# Altium schematic sheet driver.SchDoc
size A3
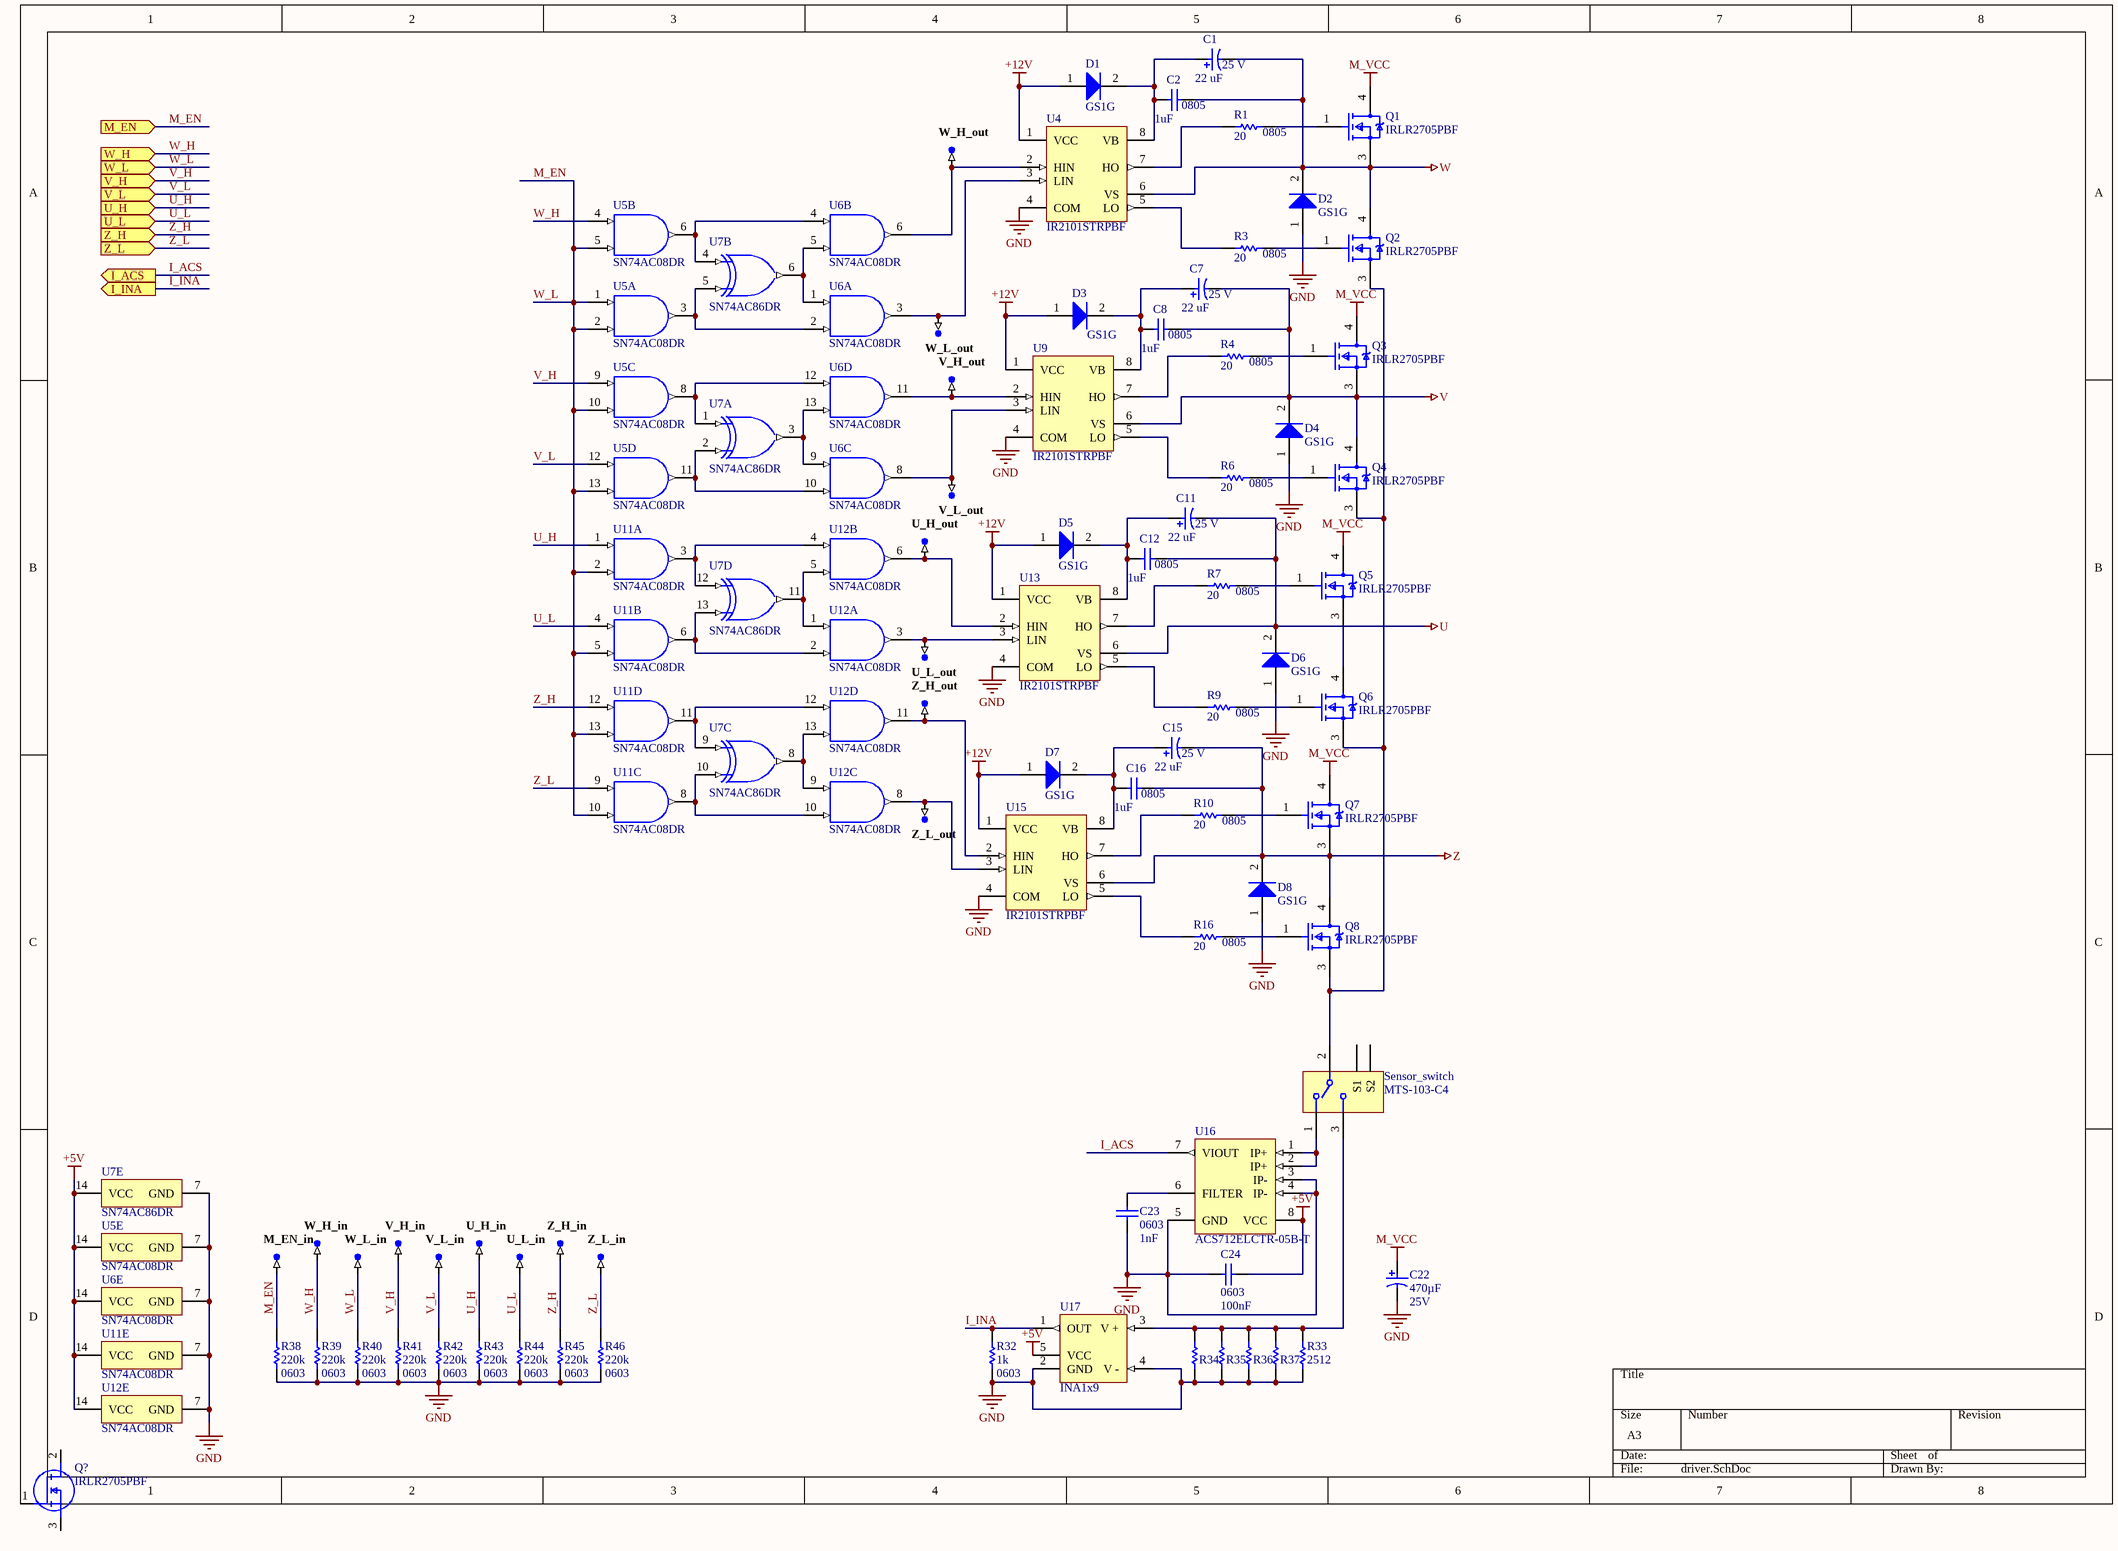
[diagram p0: driver.SchDoc]

## Parts
C1  Rated Voltage: 25 V  Capacitance: 22 uF  [PNSC-FT-V-43x43-2_V]  (hidden comment: EEE-FT1E220AR)
C2  value 1uF  Case-EIA: 0805  [CAPC0805(2012)145_M]  (hidden comment: CAP 1uF 50V 0805(2012))
C7  Rated Voltage: 25 V  Capacitance: 22 uF  [PNSC-FT-V-43x43-2_V]  (hidden comment: EEE-FT1E220AR)
C8  value 1uF  Case-EIA: 0805  [CAPC0805(2012)145_M]  (hidden comment: CAP 1uF 50V 0805(2012))
C11  Rated Voltage: 25 V  Capacitance: 22 uF  [PNSC-FT-V-43x43-2_V]  (hidden comment: EEE-FT1E220AR)
C12  value 1uF  Case-EIA: 0805  [CAPC0805(2012)145_M]  (hidden comment: CAP 1uF 50V 0805(2012))
C15  Rated Voltage: 25 V  Capacitance: 22 uF  [PNSC-FT-V-43x43-2_V]  (hidden comment: EEE-FT1E220AR)
C16  value 1uF  Case-EIA: 0805  [CAPC0805(2012)145_M]  (hidden comment: CAP 1uF 50V 0805(2012))
C22  Capacitance: 470µF  Rated Voltage: 25V  [PNSC-FP-V-G_V]  (hidden comment: EEEFP1E471AP)
C23  value 1nF  Case-EIA: 0603  [CAPC0603(1608)100_M]  (hidden comment: CAP 1nF 16V 0603(1608))
C24  Case Code (Imperial): 0603  Capacitance: 100nF  [CAPC1608X90X35ML10T15]  (hidden comment: GRM188R71H104KA93D)
D1  GS1G  [VISH-DO-214AC_V]
D2  GS1G  [VISH-DO-214AC_V]
D3  GS1G  [VISH-DO-214AC_V]
D4  GS1G  [VISH-DO-214AC_V]
D5  GS1G  [VISH-DO-214AC_V]
D6  GS1G  [VISH-DO-214AC_V]
D7  GS1G  [VISH-DO-214AC_V]
D8  GS1G  [VISH-DO-214AC_V]
M_EN_in  TP-SM-C-100  [TP-SM-C-100]  (value not drawn)  (no BOM)
Q1  IRLR2705PBF  [FP-PG-TO252-3-MFG]
Q2  IRLR2705PBF  [FP-PG-TO252-3-MFG]
Q3  IRLR2705PBF  [FP-PG-TO252-3-MFG]
Q4  IRLR2705PBF  [FP-PG-TO252-3-MFG]
Q5  IRLR2705PBF  [FP-PG-TO252-3-MFG]
Q6  IRLR2705PBF  [FP-PG-TO252-3-MFG]
Q7  IRLR2705PBF  [FP-PG-TO252-3-MFG]
Q8  IRLR2705PBF  [FP-PG-TO252-3-MFG]
Q?  IRLR2705PBF  [IRLR2705PBF]
R1  value 20  Case-EIA: 0805  [RESC0805(2012)_M]  (hidden comment: 20R 1% 0805(2012))
R3  value 20  Case-EIA: 0805  [RESC0805(2012)_M]  (hidden comment: 20R 1% 0805(2012))
R4  value 20  Case-EIA: 0805  [RESC0805(2012)_M]  (hidden comment: 20R 1% 0805(2012))
R6  value 20  Case-EIA: 0805  [RESC0805(2012)_M]  (hidden comment: 20R 1% 0805(2012))
R7  value 20  Case-EIA: 0805  [RESC0805(2012)_M]  (hidden comment: 20R 1% 0805(2012))
R9  value 20  Case-EIA: 0805  [RESC0805(2012)_M]  (hidden comment: 20R 1% 0805(2012))
R10  value 20  Case-EIA: 0805  [RESC0805(2012)_M]  (hidden comment: 20R 1% 0805(2012))
R16  value 20  Case-EIA: 0805  [RESC0805(2012)_M]  (hidden comment: 20R 1% 0805(2012))
R32  Resistance (Ohms): 1k  Package Reference: 0603  [RESC1608X55X30ML15T20]  (hidden comment: RMCF0603FT10K0)
R33  Case-EIA: 2512  [RESC2512(6432)_N]  (hidden comment: 1R 5% 2512(6432))
R34  1R 5% 2512(6432)  [RESC2512(6432)_N]  (value not drawn)
R35  1R 5% 2512(6432)  [RESC2512(6432)_N]  (value not drawn)
R36  1R 5% 2512(6432)  [RESC2512(6432)_N]  (value not drawn)
R37  1R 5% 2512(6432)  [RESC2512(6432)_N]  (value not drawn)
R38  Resistance (Ohms): 220k  Package Reference: 0603  [RESC1608X55X30ML15T20]  (hidden comment: RMCF0603FT10K0)
R39  Resistance (Ohms): 220k  Package Reference: 0603  [RESC1608X55X30ML15T20]  (hidden comment: RMCF0603FT10K0)
R40  Resistance (Ohms): 220k  Package Reference: 0603  [RESC1608X55X30ML15T20]  (hidden comment: RMCF0603FT10K0)
R41  Resistance (Ohms): 220k  Package Reference: 0603  [RESC1608X55X30ML15T20]  (hidden comment: RMCF0603FT10K0)
R42  Resistance (Ohms): 220k  Package Reference: 0603  [RESC1608X55X30ML15T20]  (hidden comment: RMCF0603FT10K0)
R43  Resistance (Ohms): 220k  Package Reference: 0603  [RESC1608X55X30ML15T20]  (hidden comment: RMCF0603FT10K0)
R44  Resistance (Ohms): 220k  Package Reference: 0603  [RESC1608X55X30ML15T20]  (hidden comment: RMCF0603FT10K0)
R45  Resistance (Ohms): 220k  Package Reference: 0603  [RESC1608X55X30ML15T20]  (hidden comment: RMCF0603FT10K0)
R46  Resistance (Ohms): 220k  Package Reference: 0603  [RESC1608X55X30ML15T20]  (hidden comment: RMCF0603FT10K0)
Sensor_switch  MTS-103-C4  [SALE-T8019L-5_V]
U4  IR2101STRPBF  [INTR-SOIC-8_V]
U5  SN74AC08DR  [D0014A_M]  (parts A,B,C,D,E of 5)
U6  SN74AC08DR  [D0014A_M]  (parts A,B,C,D,E of 5)
U7  SN74AC86DR  [D0014A_M]  (parts A,B,C,D,E of 5)
U9  IR2101STRPBF  [INTR-SOIC-8_V]
U11  SN74AC08DR  [D0014A_M]  (parts A,B,C,D,E of 5)
U12  SN74AC08DR  [D0014A_M]  (parts A,B,C,D,E of 5)
U13  IR2101STRPBF  [INTR-SOIC-8_V]
U15  IR2101STRPBF  [INTR-SOIC-8_V]
U16  ACS712ELCTR-05B-T  [ALEG-LC-8_V]
U17  INA1x9  [DIOD-SOT23-5_V]
U_H_in  TP-SM-C-100  [TP-SM-C-100]  (value not drawn)  (no BOM)
U_H_out  TP-SM-C-100  [TP-SM-C-100]  (value not drawn)  (no BOM)
U_L_in  TP-SM-C-100  [TP-SM-C-100]  (value not drawn)  (no BOM)
U_L_out  TP-SM-C-100  [TP-SM-C-100]  (value not drawn)  (no BOM)
V_H_in  TP-SM-C-100  [TP-SM-C-100]  (value not drawn)  (no BOM)
V_H_out  TP-SM-C-100  [TP-SM-C-100]  (value not drawn)  (no BOM)
V_L_in  TP-SM-C-100  [TP-SM-C-100]  (value not drawn)  (no BOM)
V_L_out  TP-SM-C-100  [TP-SM-C-100]  (value not drawn)  (no BOM)
W_H_in  TP-SM-C-100  [TP-SM-C-100]  (value not drawn)  (no BOM)
W_H_out  TP-SM-C-100  [TP-SM-C-100]  (value not drawn)  (no BOM)
W_L_in  TP-SM-C-100  [TP-SM-C-100]  (value not drawn)  (no BOM)
W_L_out  TP-SM-C-100  [TP-SM-C-100]  (value not drawn)  (no BOM)
Z_H_in  TP-SM-C-100  [TP-SM-C-100]  (value not drawn)  (no BOM)
Z_H_out  TP-SM-C-100  [TP-SM-C-100]  (value not drawn)  (no BOM)
Z_L_in  TP-SM-C-100  [TP-SM-C-100]  (value not drawn)  (no BOM)
Z_L_out  TP-SM-C-100  [TP-SM-C-100]  (value not drawn)  (no BOM)

## Ports
I_ACS (out), I_INA (out), M_EN (in), U_H (in), U_L (in), V_H (in), V_L (in), W_H (in), W_L (in), Z_H (in), Z_L (in)

## Nets
+5V: C24.2 U5.14(VCC) U6.14(VCC) U7.14(VCC) U11.14(VCC) U12.14(VCC) U16.8(VCC) U17.5(VCC)
+12V: D1.1(+) D3.1(+) D5.1(+) D7.1(+) U4.1(VCC) U9.1(VCC) U13.1(VCC) U15.1(VCC)
GND: C22.2 C23.1 C24.1 D2.1(+) D4.1(+) D6.1(+) D8.1(+) R32.1 R33.2 R34.2 R35.2 R36.2 R37.2 R38.1 R39.1 R40.1 R41.1 R42.1 R43.1 R44.1 R45.1 R46.1 U4.4(COM) U5.7(GND) U6.7(GND) U7.7(GND) U9.4(COM) U11.7(GND) U12.7(GND) U13.4(COM) U15.4(COM) U16.3(IP-) U16.4(IP-) U16.5(GND) U17.2(GND) U17.4(V_-)
M_VCC: C22.1 Q1.4(D) Q3.4(D) Q5.4(D) Q7.4(D)
U: C11.2 C12.1 D6.2(-) Q5.3(S) Q6.4(D) U13.6(VS)
V: C7.2 C8.1 D4.2(-) Q3.3(S) Q4.4(D) U9.6(VS)
W: C1.2 C2.1 D2.2(-) Q1.3(S) Q2.4(D) U4.6(VS)
Z: C15.2 C16.1 D8.2(-) Q7.3(S) Q8.4(D) U15.6(VS)
I_ACS: U16.7(VIOUT) ; port I_ACS
I_INA: R32.2 U17.1(OUT) ; port I_INA
M_EN: M_EN_in.1 R38.2 R40.2 U5.1(1A) U5.2(1B) U5.5(2B) U5.10(3B) U5.13(4B) U11.2(1B) U11.5(2B) U11.10(3B) U11.13(4B) W_L_in.1 ; port W_L, port M_EN  [also labelled W_L]
U_H: R43.2 U11.1(1A) U_H_in.1 ; port U_H
U_L: R44.2 U11.4(2A) U_L_in.1 ; port U_L
V_H: R41.2 U5.9(3A) V_H_in.1 ; port V_H
V_L: R42.2 U5.12(4A) V_L_in.1 ; port V_L
W_H: R39.2 U5.4(2A) W_H_in.1 ; port W_H
Z_H: R45.2 U11.12(4A) Z_H_in.1 ; port Z_H
Z_L: R46.2 U11.9(3A) Z_L_in.1 ; port Z_L
NetC1_1: C1.1 C2.2 D1.2(-) U4.8(VB)
NetC7_1: C7.1 C8.2 D3.2(-) U9.8(VB)
NetC11_1: C11.1 C12.2 D5.2(-) U13.8(VB)
NetC15_1: C15.1 C16.2 D7.2(-) U15.8(VB)
NetC23_2: C23.2 U16.6(FILTER)
NetQ1_1: Q1.1(G) R1.1
NetQ2_1: Q2.1(G) R3.1
NetQ2_3: Q2.3(S) Q4.3(S) Q6.3(S) Q8.3(S) Sensor_switch.2
NetQ3_1: Q3.1(G) R4.1
NetQ4_1: Q4.1(G) R6.1
NetQ5_1: Q5.1(G) R7.1
NetQ6_1: Q6.1(G) R9.1
NetQ7_1: Q7.1(G) R10.1
NetQ8_1: Q8.1(G) R16.1
NetR1_2: R1.2 U4.7(HO)
NetR3_2: R3.2 U4.5(LO)
NetR4_2: R4.2 U9.7(HO)
NetR6_2: R6.2 U9.5(LO)
NetR7_2: R7.2 U13.7(HO)
NetR9_2: R9.2 U13.5(LO)
NetR10_2: R10.2 U15.7(HO)
NetR16_2: R16.2 U15.5(LO)
NetR33_1: R33.1 R34.1 R35.1 R36.1 R37.1 Sensor_switch.3 U17.3(V_+)
NetSensor_switch_1: Sensor_switch.1 U16.1(IP+) U16.2(IP+)
NetU4_2: U4.2(HIN) U6.6(2Y) W_H_out.1
NetU4_3: U4.3(LIN) U6.3(1Y) W_L_out.1
NetU5_3: U5.3(1Y) U6.2(1B) U7.5(2B)
NetU5_6: U5.6(2Y) U6.4(2A) U7.4(2A)
NetU5_8: U5.8(3Y) U6.12(4A) U7.1(1A)
NetU5_11: U5.11(4Y) U6.10(3B) U7.2(1B)
NetU6_1: U6.1(1A) U6.5(2B) U7.6(2Y)
NetU6_8: U6.8(3Y) U9.3(LIN) V_L_out.1
NetU6_9: U6.9(3A) U6.13(4B) U7.3(1Y)
NetU6_11: U6.11(4Y) U9.2(HIN) V_H_out.1
NetU7_8: U7.8(3Y) U12.9(3A) U12.13(4B)
NetU7_9: U7.9(3A) U11.11(4Y) U12.12(4A)
NetU7_10: U7.10(3B) U11.8(3Y) U12.10(3B)
NetU7_11: U7.11(4Y) U12.1(1A) U12.5(2B)
NetU7_12: U7.12(4A) U11.3(1Y) U12.4(2A)
NetU7_13: U7.13(4B) U11.6(2Y) U12.2(1B)
NetU12_3: U12.3(1Y) U13.3(LIN) U_L_out.1
NetU12_6: U12.6(2Y) U13.2(HIN) U_H_out.1
NetU12_8: U12.8(3Y) U15.3(LIN) Z_L_out.1
NetU12_11: U12.11(4Y) U15.2(HIN) Z_H_out.1

Not connected (* = marked no-connect by the designer): Q? 1(G) 2(D) 3(S); Sensor_switch S1 S2

## Library data of the parts
C1 C7 C11 C15 = CMP-0744-00004-1: Aluminum Electrolytic Capacitor, 22 uF +/- 20%, 25 V, -55 to 105 degC, 2-Pin 4.3 x 4.3 x 6.1 mm SMD, RoHS, Tape and Reel; Manufacturer: Panasonic; Ripple Current: 160 mA; Capacitance Tolerance: +/- 20%; Packing: Tape and Reel; PackageReference: FT-V-43x43-2; DatasheetVersion: Mar-14; ComponentLink3Description: Package Specification; PackageDescription: 2-Pin SMD, Body 4.3 x 4.3 mm, Height 6.1 mm; ComponentLink1Description: Manufacturer URL; ComponentLink2Description: Datasheet; PartNumber: EEE-FT1E220AR; ComponentLink3URL: http://industrial.panasonic.com/www-data/pdf/ABA0000/ABA0000PE248.pdf; RoHS: TRUE; PackageVersion: Feb-14; Temp. Range: -55 to 105 degC; ComponentLink2URL: http://industrial.panasonic.com/www-data/pdf/ABA0000/ABA0000CE135.pdf; ComponentLink1URL: http://www.panasonic.com/industrial/electronic-components/; Mounting Technology: Surface Mount
C2 C8 C12 C16 = CMP-1036-04761-1: CAP 1uF 50V ±10% 0805 (2012 Metric) Thickness 1.45mm SMD; Tolerance: Â±10%; Case-Metric: 2012; Technology: SMT; Max Thickness: 1.45 mm; Rated Voltage: 50 V
C22 = CMP-2000-06214-1: Aluminum Electrolytic Capacitor, 470 uF, +/- 20%, 25 V, 2-Pin SMD (Size Code G), -55 to 105 degC, RoHS, Tape and Reel; Manufacturer: Panasonic; Ripple Current: 1190mA; ESR (Equivalent Series Resistance): 0.06O; Type: Can; Lifetime@Temperature: 2000Hrs@105°C; Package Reference: FP-V-G; Case Size/Dimension: Ø10x10.2mm; Mounting Technology: SurfaceMount; Datasheet Version: 03/2016; Datasheet URL: http://industrial.panasonic.com/cdbs/www-data/pdf/RDE0000/ABA0000C1184.pdf; Series: FP; Operating Temp Range: -55to+105°C; Operating Temp-Max: 105°C; Package URL: http://industrial.panasonic.com/cdbs/www-data/pdf/RDE0000/DME0000COL48.pdf; Package Description: 2-Pin Electrolytic Aluminum Capacitor, Body 10.3 x 10.3 mm; Manufacturer URL: http://www.panasonic.com/
C23 = CMP-1035-01877-1: CAP 1nF 16V ±2% 0603 (1608 Metric) Thickness 1mm SMD; Case-Metric: 1608; Tolerance: Â±2%; Max Thickness: 1 mm; Rated Voltage: 16 V; Technology: SMT
C24 = CMP-2100-03643-1: Chip Capacitor, 0.1 uF, +/- 10%, 50 V, -55 to 125 degC, 0603 (1608 Metric), RoHS, Tape and Reel; Manufacturer: Murata; Dielectric Material: Ceramic; Voltage Rating: 50V; Dielectric: X7R; Insulation Resistance: 10GR; Case Code (Metric): 1608; Lead Free: LeadFree; Depth: 0.8mm; Number of Pins: 2; Radiation Hardening: No; Case/Package: 0603; Manufacturer URL: http://www.murata.com/; Packaging: TapeandReel; Length: 1.6mm; Contact Plating: Tin; Datasheet URL: http://psearch.en.murata.com/capacitor/product/GRM188R71H104KA93%23.pdf; Tolerance: 10%; Min Operating Temperature: -55degC; RoHSCompliant: true; Voltage: 50V; Termination: SMD/SMT; Mount: SurfaceMount; Material: Ceramic; Package Quantity: 1; Height: 0.8mm; Thickness: 0.035inch; REACH SVHC: NoSVHC; Max Operating Temperature: 125degC; Width: 0.8mm; Package Reference: 0603; Voltage Rating (DC): 50V; Datasheet Version: 42675.0; Package Description: 2-Pin Surface Mount Device, Body 1.6 x 0.8 mm
D1-D8 = CMP-1666-00011-1: DIODE GPP 1A 400V SMA; PartNumber: S1G-E3/61T; ComponentLink1Description: Datasheet; ComponentLink1URL: http://www.vishay.com/docs/88711/s1.pdf; PackageReference: DO-214AC
M_EN_in U_H_in U_H_out U_L_in U_L_out V_H_in V_H_out V_L_in V_L_out W_H_in W_H_out W_L_in W_L_out Z_H_in Z_H_out Z_L_in Z_L_out = CMP-0484-00002-2: Test Point, Surface Mount, Circular, Pad Diameter 1 mm; Manufacturer: No Vendor; PartNumber: TP-SM-C-100
Q1-Q8 = CMP-32901-000108-1: MOSFET N-CH 55V 44A DPAK; Manufacturer: Infineon; Manufacturer Part Number: IRFR1205TRPBF; Input Capacitace At Vds: 1300pF @ 25V; Depletion Mode: False; Pulse Drain Current: 160A; Gate Charge At Vgs: 65nC @ 10V; Gate To Source Voltage: 20V; Turn On Delay Time: 7.3ns; Number Of Channels: 1; Transconductance: 17S; Reverse Recovery Time: 65ns; Threshold Vgs Max: 4V; Turn Off Delay Time: 47ns; Threshold Vgs Min: 2V; Reverse Recovery Charge: 160nC; Rthja Max: 50°C/W; Drain To Source Resistance: 0.027Ω; Max Junction Temp: +175°C; Max Forward Diode Voltage: 1.3V; Power Dissipation: 107W; RoHS: TRUE; Category: Trans; Height: 2.52mm; Drain To Source Voltage: 55V; Device Class L1: Discrete Semiconductors; Octopart: https://octopart.com/irfr1205trpbf-infineon-65874068; Drain To Source Breakdown Voltage: 55V; Number Of N Channels: 1; ComponentLink2URL: https://www.infineon.com/dgdl/irfr1205pbf.pdf?fileId=5546d462533600a40153562d17792047; Temperature Range Low: -55°C; Temperature: -55°C to +175°C; Digikey Description: MOSFET N-CH 55V 44A DPAK; Device Class L2: Transistors; Temperature Range High: +175°C; Package: PG-TO252-3; Automotive: No; Continuous Drain Current: 44A; Device Class L3: MOSFETs; ComponentLink2Description: Datasheet; Footprint Url: https://www.infineon.com/cms/en/product/packages/PG-TO252/PG-TO252-3-901/; Lead Free: Yes
Q? = IRLR2705PBF: MOSFET (N-Channel); Manufacturer_Name: Infineon; Datasheet Link: https://www.infineon.com/dgdl/irlr2705pbf.pdf?fileId=5546d462533600a40153566cb38f2673; Height: 2.52mm; Manufacturer_Part_Number: IRLR2705PBF; Mouser Part Number: 942-IRLR2705PBF; Mouser Price/Stock: https://www.mouser.co.uk/ProductDetail/Infineon-Technologies/IRLR2705PBF?qs=nrWyqPbesnUy1Tll%252BwV04A%3D%3D; Arrow Part Number: IRLR2705PBF; Arrow Price/Stock: https://www.arrow.com/en/products/irlr2705pbf/infineon-technologies-ag
R1 R3 R4 R6 R7 R9 R10 R16 = CMP-1013-00316-1: 20R 0.125W 1% 0805 (2012 Metric)  SMD; Case-Metric: 2012; Tolerance: 1 %; Technology: SMT; Power: 0.125 W
R32 R38-R46 = CMP-2000-06990-1: Chip Resistor, 10 KOhm, +/- 1%, 0.1 W, -55 to 155 degC, 0603 (1608 Metric), RoHS, Tape and Reel; Manufacturer: Stackpole-Electronics-Inc.; Temperature Coefficient: ±100ppm/°C; Power (Watts): 0.1W,1/10W; Package / Case: 0603(1608Metric); Datasheet Version: 01/2017; Features: AutomotiveAEC-Q200; Packaging: CutTape(CT); Series: RMCF; Tolerance: ±1%; Manufacturer URL: https://www.seielect.com/; Datasheet URL: https://www.seielect.com/Catalog/SEI-RMCF_RMCP.pdf; Supplier Device Package: 0603; Number of Terminations: 2; Family: ChipResistor-SurfaceMount; Mounting Technology: SurfaceMount; Package Description: 2-Pin Surface Mount Device, Body 1.55 x 0.8 mm; Operating Temperature: -55°C~155°C; Composition: ThickFilm; Category: Resistors
R33 = CMP-1018-00002-1: 1R 1W 5% 2512 (6432 Metric)  SMD; Case-Metric: 6432; Value: 1.00 Ohm; Technology: SMT; Power: 1 W; Tolerance: 5 %
R34-R37 = CMP-1018-00002-1: 1R 1W 5% 2512 (6432 Metric)  SMD; Case-Metric: 6432; Value: 1.00 Ohm; Case-EIA: 2512; Technology: SMT; Power: 1 W; Tolerance: 5 %
Sensor_switch = CMP-0428-00001-1: Toggle Switch, SPDT, Through Hole, 3 Terminals; Manufacturer: Salecom Electronics; PartNumber: T8019L-TNQ; Mechanical Life: 50,000 cycles; ComponentLink2Description: Datasheet; PackageReference: T8019L; ComponentLink1Description: Manufacturer URL; PackageDescription: Toggle Switch, 3 Leads, Vertical Right Angle; ComponentLink1URL: http://www.salecom.com/; DatasheetVersion: Jul-12; ComponentLink2URL: http://www.salecom.com/pdf/toggle%20switch_T80-T.pdf; Operating Temperature: -30 to +85 degC; Mounting Technology: Through Hole
U4 U9 U13 U15 = CMP-1671-00001-2: IC DRIVER HIGH/LOW SIDE 8SOIC; PartNumber: IR2181STRPBF; Manufacturer: International Rectifier; ComponentLink1Description: Datasheet; ComponentLink1URL: http://www.infineon.com/dgdl/ir2181.pdf?fileId=5546d462533600a4015355c93cdd16ce; PackageReference: SOIC-8
U5 U6 U11 U12 = CMP-0777-00059-2: Quadruple 2-Input Positive-AND Gates, D0014A, LARGE T&R; Manufacturer: Texas Instruments; F @ Nom Voltage(Max)(Mhz): 100; Output Drive (IOL/IOH)(Max)(mA): -24/24; Input Type: CMOS; Technology Family: AC; Voltage(Nom)(V): 3.3,5; Bits(#): 4; VCC(Min)(V): 2; ICC @ Nom Voltage(Max)(mA): 0.02; VCC(Max)(V): 6; Schmitt Trigger: No; Rating: Catalog; tpd @ Nom Voltage(Max)(ns): 10,8.5; DatasheetVersion: SCAS536D; PartNumber: SN74AC08DR; PackageReference: D0014A; ComponentLink1Description: Manufacturer URL; Generic Part Number: SN74AC08; ComponentLink2Description: Datasheet; ComponentLink2URL: http://www.ti.com/lit/ds/symlink/sn74ac08.pdf; ComponentLink1URL: http://www.ti.com/; Operating Temperature Range(C): -40 to 85; Output Type: CMOS; PartId: 1
U7 = CMP-0778-00016-3: Quadruple 2-Input Exclusive-OR Gates, D0014A, LARGE T&R; Manufacturer: Texas Instruments; Technology Family: AC; VCC(Min)(V): 2; Rating: Catalog; Output Type: CMOS; ICC @ Nom Voltage(Max)(mA): 0.02; F @ Nom Voltage(Max)(Mhz): 100; Output Drive (IOL/IOH)(Max)(mA): 24/-24; Voltage(Nom)(V): 3.3,5; Schmitt Trigger: No; VCC(Max)(V): 5.5; Bits(#): 4; tpd @ Nom Voltage(Max)(ns): 12.5,9; Generic Part Number: SN74AC86; DatasheetVersion: SCAS533C; PackageReference: D0014A; Operating Temperature Range(C): -40 to 85; Input Type: CMOS; PartId: 1
U16 = CMP-2000-04989-1: Linear Current Sensor, 4.5 to 5.5 V, 10 mA Output Current, -40 to 85 degC, 8-Pin SOIC (LC), RoHS, Tape and Reel; Manufacturer: Allegro Microsystems; SVHC: NoSVHC(19-Dec-2012); Supply Voltage Min: 4.5V; Accuracy: 1.5%; No. of Pins: 8; Supply Voltage Max: 5.5V; Bandwidth: 50kHz; Quiescent Current: 8mA; Supply Voltage Range: 4.5Vto5.5V; Polarisation: Unipolar; Package Description: 8-Pin Small Outline Integrated Circuit, Body 4.9 x 3.9 mm, Pitch 1.27 mm; Operating Temperature Min: -40degC; Datasheet URL: http://www.allegromicro.com/~/media/Files/Datasheets/ACS712-Datasheet.ashx?la=en; Operating Temperature Range: -40degCto+85degC; MSL: MSL2-1year; Sensor Case Style: SOIC; Termination Type: SMD; Manufacturer URL: http://www.allegromicro.com/; Sensor / Transducer Type: Current; Package Reference: LC-8; Operating Temperature Max: 85degC; Datasheet Version: Rev. 15, 11/2012
U17 = INA169